# Altium project Arduino-RedBoard.PrjPcb
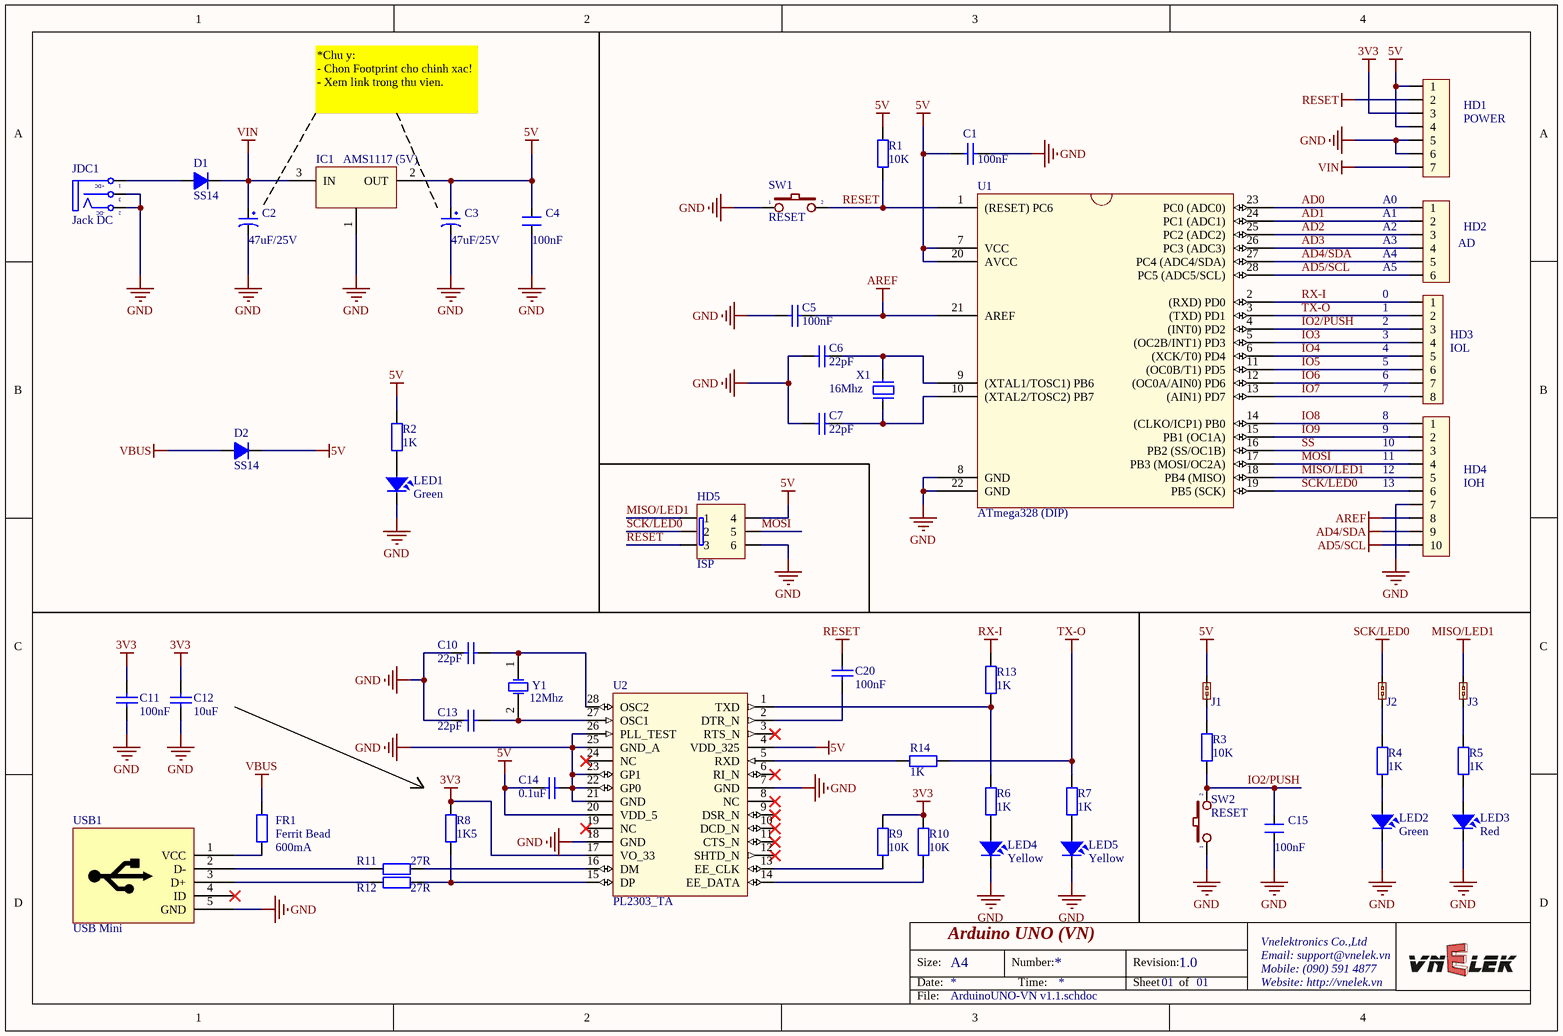
[diagram p0: ArduinoUNO-VN v1.1.schdoc]
1 sheet, 53 parts. Net scope: global (net labels, ports and power ports of the same name join across sheets).

## Sheet ArduinoUNO-VN v1.1.schdoc: Arduino UNO (VN)
size A4; Author: Tran Tuan; CompanyName: Vnelektronics Co.,Ltd; Organization: Vnelektronics Co.,Ltd; Address1: 776 Ton Duc Thang; Address2: Lien Chieu, Da Nang; Revision: 1.0; SheetNumber: 01; SheetTotal: 01

### Parts
C1  value 100nF  [C0603]  (hidden comment: 5AK102KABAA)
C2  47uF/25V
C3  47uF/25V
C4  100nF  [C0603]
C5  value 100nF  [C0603]  (hidden comment: 5AK102KABAA)
C6  value 22pF  [C0603]  (hidden comment: 5AK102KABAA)
C7  value 22pF  [C0603]  (hidden comment: 5AK102KABAA)
C10  value 22pF  [C0603]  (hidden comment: CC0603JRNPO9BN)
C11  value 100nF  [C0603]  (hidden comment: CC0603JRNPO9BN)
C12  value 10uF  [C0805]  (hidden comment: C0805KRX7R7BB)
C13  value 22pF  [C0603]  (hidden comment: CC0603JRNPO9BN)
C14  value 0.1uF  [C0603]  (hidden comment: CC0603JRNPO9BN)
C15  100nF  [C0603]
C20  value 100nF  (hidden comment: CC0603JRNPO9BN)
D1  SS14  [SS14]
D2  SS14  [SS14]
FR1  Ferrit Bead  value 600mA  [CB2012]
HD1  POWER  [Header_7]
HD2  AD  [Header_6]
HD3  IOL  [Header_8]
HD4  IOH  [Header_10]
HD5  ISP  [Header_3x2]
IC1  AMS1117 (5V)  [AMS1117-5.0V]
J1  Short Jump  [Header_2]  (value not drawn)
J2  Short Jump  [Header_2]  (value not drawn)
J3  Short Jump  [Header_2]  (value not drawn)
JDC1  Jack DC  [DC-IN]
LED1  Green  [Led 0805Y]
LED2  Green  [Led 0805G]
LED3  Red  [Led 0805R]
LED4  Yellow  [Led 0805G]
LED5  Yellow  [Led 0805R]
R1  value 10K  [RESC2012L]  (hidden comment: Res2)
R2  value 1K  [RESC2012L]  (hidden comment: Res2)
R3  value 10K  [RM06JTN (0603)]  (hidden comment: Res2)
R4  value 1K  [RM06JTN (0603)]  (hidden comment: Res2)
R5  value 1K  [RM06JTN (0603)]  (hidden comment: Res2)
R6  value 1K  [RM06JTN (0603)]  (hidden comment: Res2)
R7  value 1K  [RM06JTN (0603)]  (hidden comment: Res2)
R8  value 1K5  [RM06JTN (0603)]  (hidden comment: RM06JTN)
R9  value 10K  [RM06JTN (0603)]  (hidden comment: RM06JTN)
R10  value 10K  [RM06JTN (0603)]  (hidden comment: RM06JTN)
R11  value 27R  [RM06JTN (0603)]  (hidden comment: Res2)
R12  value 27R  [RM06JTN (0603)]  (hidden comment: Res2)
R13  value 1K  [RM06JTN (0603)]  (hidden comment: Res2)
R14  value 1K  [RM06JTN (0603)]  (hidden comment: Res2)
SW1  RESET  [BUTTON 2PIN TRON]
SW2  RESET  [BUTTON 2PIN TRON]
U1  ATmega328 (DIP)  [ATmega328 (DIP)]
U2  PL2303_TA  [PL2303HX]
USB1  USB Mini  [USBMNIB]
X1  16Mhz  [CRYSTAL]
Y1  12Mhz  [CSTCE16M0V53-R0]

### Nets
3V3: C11.2 C12.1 HD1.3 R8.1 R9.1 R10.1 U2.17(VO_33)
5V: C1.2 C3.1 C4.2 C14.1 D2.2(K) HD1.1 HD1.4 HD5.4 IC1.2(OUT) J1.2 R1.2 R2.2 U1.7(VCC) U1.20(AVCC) U2.4(VDD_325) U2.20(VDD_5)
AD4/SDA: HD2.5 HD4.9 U1.27(PC4_(ADC4/SDA))
AD5/SCL: HD2.6 HD4.10 U1.28(PC5_(ADC5/SCL))
AREF: C5.2 HD4.8 U1.21(AREF)
GND: C1.1 C2.2 C3.2 C4.1 C5.1 C6.1 C7.1 C10.1 C11.1 C12.2 C13.1 C14.2 C15.1 HD1.5 HD1.6 HD4.7 HD5.6 IC1.1(GND) JDC1.2(TN) JDC1.3(S) LED1.2 LED2.2 LED3.2 LED4.2 LED5.2 SW1.1 SW2.1 U1.8(GND) U1.22(GND) U2.7(GND) U2.18(GND) U2.21(GND) U2.22(GP0) U2.23(GP1) U2.25(GND_A) U2.26(PLL_TEST) USB1.5(GND)
MISO/LED1: HD4.5 HD5.1 J3.2 U1.18(PB4_(MISO))
RESET: C20.2 HD1.2 HD5.3 R1.1 SW1.2 U1.1((RESET)_PC6)
RX-I: HD3.1 R13.1 U1.2((RXD)_PD0)
SCK/LED0: HD4.6 HD5.2 J2.2 U1.19(PB5_(SCK))
TX-O: HD3.2 R7.2 R14.1 U1.3((TXD)_PD1)
VBUS: D2.1(A) FR1.2
VIN: C2.1 D1.2(K) HD1.7 IC1.3(IN)
AD0: HD2.1 U1.23(PC0_(ADC0))
AD1: HD2.2 U1.24(PC1_(ADC1))
AD2: HD2.3 U1.25(PC2_(ADC2))
AD3: HD2.4 U1.26(PC3_(ADC3))
IO2/PUSH: C15.2 HD3.3 R3.1 SW2.2 U1.4((INT0)_PD2)
IO3: HD3.4 U1.5((OC2B/INT1)_PD3)
IO4: HD3.5 U1.6((XCK/T0)_PD4)
IO5: HD3.6 U1.11((OC0B/T1)_PD5)
IO6: HD3.7 U1.12((OC0A/AIN0)_PD6)
IO7: HD3.8 U1.13((AIN1)_PD7)
IO8: HD4.1 U1.14((CLKO/ICP1)_PB0)
IO9: HD4.2 U1.15(PB1_(OC1A))
MOSI: HD4.4 HD5.5 U1.17(PB3_(MOSI/OC2A))
SS: HD4.3 U1.16(PB2_(SS/OC1B))
NetC6_2: C6.2 U1.9((XTAL1/TOSC1)_PB6) X1.2
NetC7_2: C7.2 U1.10((XTAL2/TOSC2)_PB7) X1.1
NetC10_2: C10.2 U2.28(OSC2) Y1.1(OSC1)
NetC13_2: C13.2 U2.27(OSC1) Y1.2(OSC2)
NetC20_1: C20.1 U2.2(DTR_N)
NetD1_1: D1.1(A) JDC1.1(T)
NetFR1_1: FR1.1 USB1.1(VCC)
NetJ1_1: J1.1 R3.2
NetJ2_1: J2.1 R4.2
NetJ3_1: J3.1 R5.2
NetLED1_1: LED1.1 R2.1
NetLED2_1: LED2.1 R4.1
NetLED3_1: LED3.1 R5.1
NetLED4_1: LED4.1 R6.1
NetLED5_1: LED5.1 R7.1
NetR6_2: R6.2 R13.2 U2.1(TXD)
NetR8_2: R8.2 R12.1 U2.15(DP)
NetR9_2: R9.2 U2.13(EE_CLK)
NetR10_2: R10.2 U2.14(EE_DATA)
NetR11_1: R11.1 U2.16(DM)
NetR11_2: R11.2 USB1.2(D-)
NetR12_2: R12.2 USB1.3(D+)
NetR14_2: R14.2 U2.5(RXD)

Not connected (* = marked no-connect by the designer): U2 3(RTS_N)* 6(RI_N)* 8(NC)* 9(DSR_N)* 10(DCD_N)* 11(CTS_N)* 12(SHTD_N)* 19(NC)* 24(NC)*; USB1 4(ID)*

### Notes on the sheet
- *Chu y:
  - Chon Footprint cho chinh xac!
  - Xem link trong thu vien.
- A0
- (near HD2) A1
- (near HD2) A2
- (near HD2) A3
- 0
- 1
- (near HD2) A4
- A5
- 2
- (near HD3) 3
- (near HD3) 4
- (near HD3) 5
- 6
- 7
- 8
- 9
- (near HD4) 10
- (near HD4) 11
- (near HD4) 12
- (near HD4) 13
- Size:
- Date:
- Number:
- Time:
- Revision:
- Sheet
- of
- Vnelektronics Co.,Ltd
- Mobile: (090) 591 4877
- Email: support@vnelek.vn
- Website: http://vnelek.vn
- File:
- (in symbol DCIN) +DC; -DC

### Library data of the parts
C1 C5-C7 = 5AK102KABAA: CAP NPO CAPNTO 1nF 100V 10%; ComponentLink1Description: Datasheet; ComponentLink1URL: D:\Dropbox\Datasheets\Passive Components\Capacitors\AVX Disc Ceramic Capacitors.pdf; Unit Price: 0.003
C2 C3 = CP1: Supplier: http://banlinhkien.vn/goods-2216-tu-nhom-47uf-25v-6-3x5-5mm.html#.U9cKbkBbjIU
C4 C15 = CN2: Cap np 104 => 105pF; Value: 0.1uF
C10 C13 = Cap: 22pF/50V ±5% NPO SMD-0603 Capacitor; Published: 8-Jun-2000; LatestRevisionDate: 17-Jul-2002; LatestRevisionNote: Re-released for DXP Platform.; PackageReference: RAD-0.3; Publisher: Altium Limited; PackageDescription: Radial Cap, Thru-Hole; 2 Leads; 0.3 in Pin Spacing
C11 C14 C20 = Cap: 100nF/50V ±10% X7R SMD-0603 Capacitor; Published: 8-Jun-2000; LatestRevisionDate: 17-Jul-2002; LatestRevisionNote: Re-released for DXP Platform.; PackageReference: RAD-0.3; Publisher: Altium Limited; PackageDescription: Radial Cap, Thru-Hole; 2 Leads; 0.3 in Pin Spacing
C12 = Cap: 10uF/16V ±10% X7R SMD-0805 Capacitor; Published: 8-Jun-2000; LatestRevisionDate: 17-Jul-2002; LatestRevisionNote: Re-released for DXP Platform.; PackageReference: RAD-0.3; Publisher: Altium Limited; PackageDescription: Radial Cap, Thru-Hole; 2 Leads; 0.3 in Pin Spacing
D1 D2 = D1A: Diode 1A; Value: 1N4007
FR1 = Res2: Supplier: http://tme.vn/Product.aspx?id=733#page=pro_info
HD1 = Hed7: Header 7; Value: Header 5
HD2 = Hed6: Header 6; Value: Header 5
HD3 = Hed8: Hedear 8; Creat by: VanDungEvn@Gmail.com
HD4 = Hed10: Header 10; Value: Header 5
HD5 = HED3x2: Header 3x2; Value: Header 3x2
IC1 = AMS1117: 1A LOW DROPOUT VOLTAGE REGULATOR
J1-J3 = ShortJump
JDC1 = DCIN: Jac DC input; Value: Jac DC
LED1-LED5 = LED: LED Single colour Green and Red; Value: LED 3 ly Single Colour
R1-R7 R11-R14 = Res2: Resistor; Published: 8-Jun-2000; LatestRevisionDate: 17-Jul-2002; LatestRevisionNote: Re-released for DXP Platform.; PackageReference: AXIAL-0.4; Publisher: Altium Limited; PackageDescription: Axial Device, Thru-Hole; 2 Leads; 0.4 in Pin Spacing
R8 = Res2: 1.5K ±5% SMD-0603 Resistor; Published: 8-Jun-2000; LatestRevisionDate: 17-Jul-2002; LatestRevisionNote: Re-released for DXP Platform.; PackageReference: AXIAL-0.4; Publisher: Altium Limited; PackageDescription: Axial Device, Thru-Hole; 2 Leads; 0.4 in Pin Spacing
R9 R10 = Res2: 10K ±5% SMD-0603 Resistor; Published: 8-Jun-2000; LatestRevisionDate: 17-Jul-2002; LatestRevisionNote: Re-released for DXP Platform.; PackageReference: AXIAL-0.4; Publisher: Altium Limited; PackageDescription: Axial Device, Thru-Hole; 2 Leads; 0.4 in Pin Spacing
SW1 SW2 = SW2: Switch button 2 pin; Value: SW chip 2 pin
U1 = ATmega328_1: Atmel 8-bit Microcontroller
U2 = PL2303_HXA: USB to UART,28pin,EEPROM extract
USB1 = USB_M
X1 = XT2: Crystal SMD; Value: 16Mhz SMD
Y1 = XTAL: 12Mhz SMD